# Altium schematic sheet TXMIX-SE.SchDoc: Transmitter Mixer
size E; CheckedBy: J. Brinton; CompanyName: Signal Laboratories, Inc.; DrawnBy: J. Brinton; Engineer: J. Brinton; Address1: 3479 Edison Way; Address2: Menlo Park CA 94025; Address3: +1 (877) 778-8435; Address4: siglabs.com; DocumentNumber: 55; Revision: 1; SheetNumber: 56; SheetTotal: 58
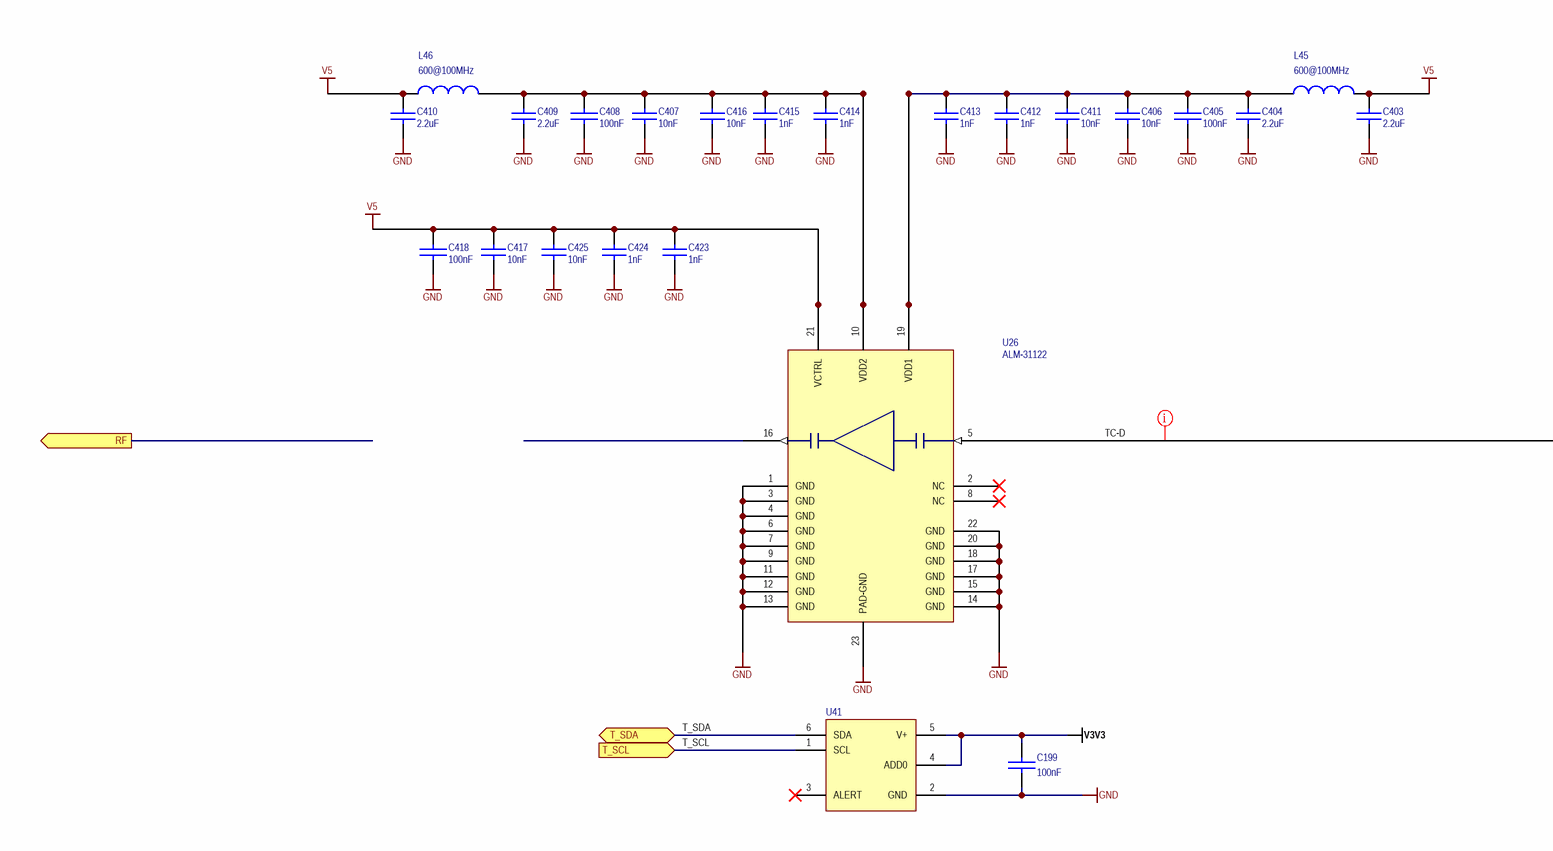
[diagram p0: TXMIX-SE.SchDoc, left]
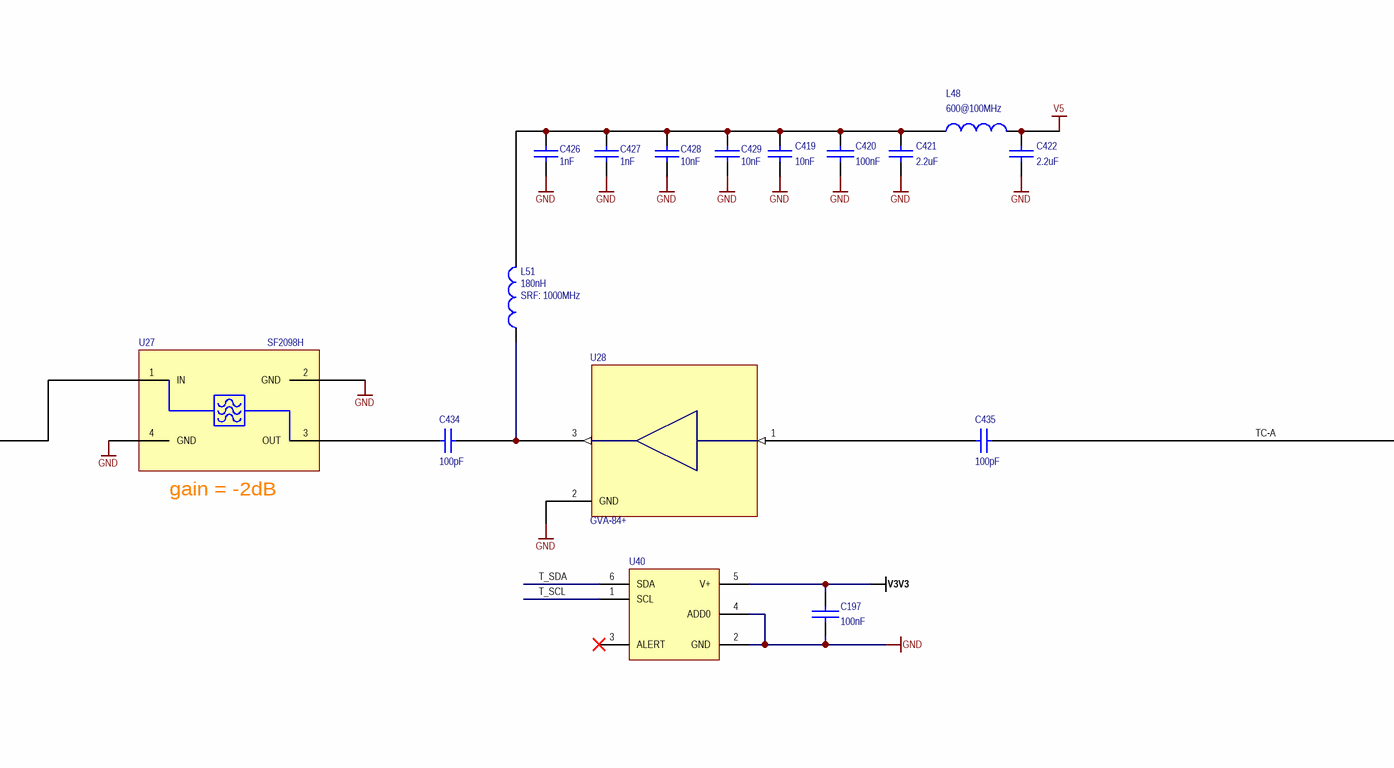
[diagram p1: TXMIX-SE.SchDoc, middle]
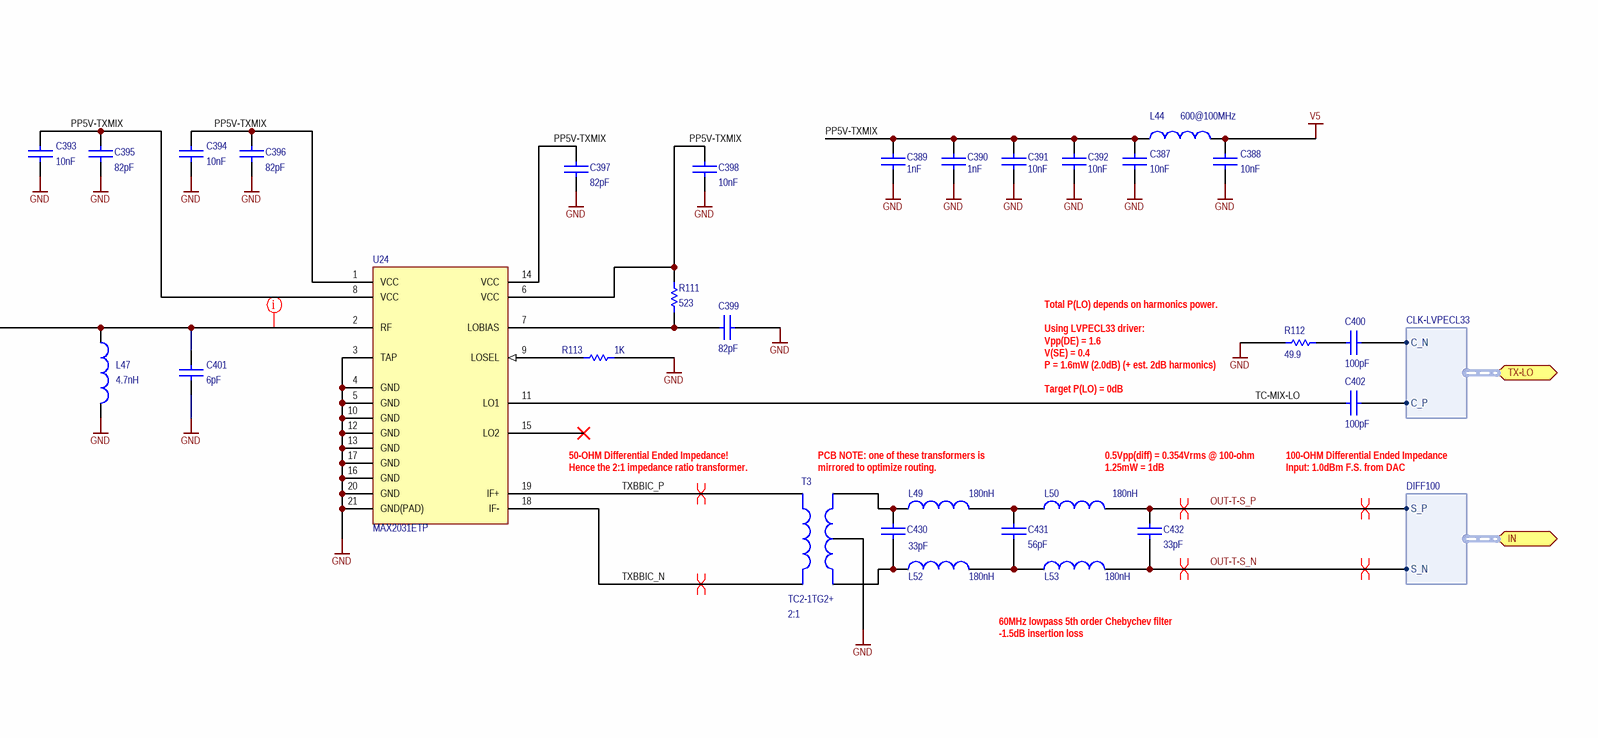
[diagram p2: TXMIX-SE.SchDoc, right]

## Parts
C197  value 100nF  [CAPC100X50X55L25N]  (hidden comment: GRM155R71C104KA88J)
C199  value 100nF  [CAPC100X50X55L25N]  (hidden comment: GRM155R71C104KA88J)
C387  value 10nF  [CAPC100X50X55L25N]  (hidden comment: GRM155R71H103KA88)
C388  value 10nF  [CAPC100X50X55L25N]  (hidden comment: GRM155R71H103KA88)
C389  value 1nF  [CAPC100X50X55L25N]  (hidden comment: GRM155R71H102KA01)
C390  value 1nF  [CAPC100X50X55L25N]  (hidden comment: GRM155R71H102KA01)
C391  value 10nF  [CAPC100X50X55L25N]  (hidden comment: GRM155R71H103KA88)
C392  value 10nF  [CAPC100X50X55L25N]  (hidden comment: GRM155R71H103KA88)
C393  value 10nF  [CAPC100X50X55L25N]  (hidden comment: GRM155R71H103KA88)
C394  value 10nF  [CAPC100X50X55L25N]  (hidden comment: GRM155R71H103KA88)
C395  value 82pF  [CAPC100X50X55L25N]  (hidden comment: VJ0402D820JXXAJ)
C396  value 82pF  [CAPC100X50X55L25N]  (hidden comment: VJ0402D820JXXAJ)
C397  value 82pF  [CAPC100X50X55L25N]  (hidden comment: VJ0402D820JXXAJ)
C398  value 10nF  [CAPC100X50X55L25N]  (hidden comment: GRM155R71H103KA88)
C399  value 82pF  [CAPC100X50X55L25N]  (hidden comment: VJ0402D820JXXAJ)
C400  value 100pF  [CAPC100X50X55L25N]  (hidden comment: CBR04C101F3GAC)
C401  value 6pF  [CAPC100X50X55L25N]  (hidden comment: GJM1555C1H6R0CB01D)
C402  value 100pF  [CAPC100X50X55L25N]  (hidden comment: CBR04C101F3GAC)
C403  value 2.2uF  [0805]  (hidden comment: GRM188R71A225KE15D)
C404  value 2.2uF  [0805]  (hidden comment: GRM188R71A225KE15D)
C405  value 100nF  [CAPC100X50X55L25N]  (hidden comment: GRM155R71C104KA88J)
C406  value 10nF  [CAPC100X50X55L25N]  (hidden comment: GRM155R71H103KA88)
C407  value 10nF  [CAPC100X50X55L25N]  (hidden comment: GRM155R71H103KA88)
C408  value 100nF  [CAPC100X50X55L25N]  (hidden comment: GRM155R71C104KA88J)
C409  value 2.2uF  [0805]  (hidden comment: GRM188R71A225KE15D)
C410  value 2.2uF  [0805]  (hidden comment: GRM188R71A225KE15D)
C411  value 10nF  [CAPC100X50X55L25N]  (hidden comment: GRM155R71H103KA88)
C412  value 1nF  [CAPC100X50X55L25N]  (hidden comment: GRM155R71H102KA01)
C413  value 1nF  [CAPC100X50X55L25N]  (hidden comment: GRM155R71H102KA01)
C414  value 1nF  [CAPC100X50X55L25N]  (hidden comment: GRM155R71H102KA01)
C415  value 1nF  [CAPC100X50X55L25N]  (hidden comment: GRM155R71H102KA01)
C416  value 10nF  [CAPC100X50X55L25N]  (hidden comment: GRM155R71H103KA88)
C417  value 10nF  [CAPC100X50X55L25N]  (hidden comment: GRM155R71H103KA88)
C418  value 100nF  [CAPC100X50X55L25N]  (hidden comment: GRM155R71C104KA88J)
C419  value 10nF  [CAPC100X50X55L25N]  (hidden comment: GRM155R71H103KA88)
C420  value 100nF  [CAPC100X50X55L25N]  (hidden comment: GRM155R71C104KA88J)
C421  value 2.2uF  [0805]  (hidden comment: GRM188R71A225KE15D)
C422  value 2.2uF  [0805]  (hidden comment: GRM188R71A225KE15D)
C423  value 1nF  [CAPC100X50X55L25N]  (hidden comment: GRM155R71H102KA01)
C424  value 1nF  [CAPC100X50X55L25N]  (hidden comment: GRM155R71H102KA01)
C425  value 10nF  [CAPC100X50X55L25N]  (hidden comment: GRM155R71H103KA88)
C426  value 1nF  [CAPC100X50X55L25N]  (hidden comment: GRM155R71H102KA01)
C427  value 1nF  [CAPC100X50X55L25N]  (hidden comment: GRM155R71H102KA01)
C428  value 10nF  [CAPC100X50X55L25N]  (hidden comment: GRM155R71H103KA88)
C429  value 10nF  [CAPC100X50X55L25N]  (hidden comment: GRM155R71H103KA88)
C430  value 33pF  [CAPC100X50X55L25N]  (hidden comment: GRM1555C1H330JA01D)
C431  value 56pF  [CAPC100X50X55L25N]  (hidden comment: GRM1555C1H560JA01D)
C432  value 33pF  [CAPC100X50X55L25N]  (hidden comment: GRM1555C1H330JA01D)
C434  value 100pF  [CAPC100X50X55L25N]  (hidden comment: CBR04C101F3GAC)
C435  value 100pF  [CAPC100X50X55L25N]  (hidden comment: CBR04C101F3GAC)
L44  value 600@100MHz  [INDC1005X55N]  (hidden comment: BLM15PX601SN1D)
L45  value 600@100MHz  [INDC1005X55N]  (hidden comment: BLM15PX601SN1D)
L46  value 600@100MHz  [INDC1005X55N]  (hidden comment: BLM15PX601SN1D)
L47  value 4.7nH  [0603]  (hidden comment: LQG18HN4N7S00D)
L48  value 600@100MHz  [INDC1005X55N]  (hidden comment: BLM15PX601SN1D)
L49  value 180nH  [0603]  (hidden comment: LQW18ANR18G00D)
L50  value 180nH  [0603]  (hidden comment: LQW18ANR18G00D)
L51  value 180nH  SRF: 1000MHz  [INDC1005X55N]  (hidden comment: LQW15CNR18J1ZD)
L52  value 180nH  [0603]  (hidden comment: LQW18ANR18G00D)
L53  value 180nH  [0603]  (hidden comment: LQW18ANR18G00D)
R111  value 523  [0603]  (hidden comment: RC0603FR-07523RL)
R112  value 49.9  [0603]  (hidden comment: ERJ-3EKF49R9V)
R113  value 1K  [RESC1005X40N]  (hidden comment: RC0402FR-071KL)
T3  value 2:1  [AT224-1A]  (hidden comment: TC2-1TG2+)
U24  MAX2031ETP  [QFN21P65_500X500X80L55X30T320N]
U26  ALM-31122  [ALM-31122]
U27  SF2098H  [SM2016-4]
U28  GVA-84+  [SOT89]
U40  TMP116AIDRVT  [SON7P65_200X200X80L25X30T170X110N]  (value not drawn)
U41  TMP116AIDRVT  [SON7P65_200X200X80L25X30T170X110N]  (value not drawn)

## Ports
IN (harness DIFF100), RF (out), T_SCL (in), T_SDA (bidir), TX-LO (harness CLK-LVPECL33)

## Harnesses
CLK-LVPECL33: C_P, C_N
DIFF100: S_P, S_N

## Nets
GND: C197.1 C199.1 C387.1 C388.1 C389.1 C390.1 C391.1 C392.1 C393.1 C394.1 C395.1 C396.1 C397.1 C398.1 C399.2 C401.1 C403.1 C404.1 C405.1 C406.1 C407.1 C408.1 C409.1 C410.1 C411.2 C412.2 C413.2 C414.2 C415.2 C416.2 C417.1 C418.1 C419.1 C420.1 C421.1 C422.1 C423.2 C424.2 C425.2 C426.1 C427.1 C428.1 C429.1 L47.1 R112.1 R113.2 T3.2(SecCT) U24.3(TAP) U24.4(GND) U24.5(GND) U24.10(GND) U24.12(GND) U24.13(GND) U24.16(GND) U24.17(GND) U24.20(GND) U24.21(GND(PAD)) U26.1(GND) U26.3(GND) U26.4(GND) U26.6(GND) U26.7(GND) U26.9(GND) U26.11(GND) U26.12(GND) U26.13(GND) U26.14(GND) U26.15(GND) U26.17(GND) U26.18(GND) U26.20(GND) U26.22(GND) U26.23(PAD-GND) U27.2(GND) U27.4(GND) U28.2(GND) U40.2(GND) U40.4(ADD0) U41.2(GND)
V3V3: C197.2 C199.2 U40.5(V+) U41.4(ADD0) U41.5(V+)
V5: C388.2 C403.2 C410.2 C417.2 C418.2 C422.2 C423.1 C424.1 C425.1 L44.1 L45.2 L46.1 L48.1 U26.21(VCTRL)
OUT-T-S_N: C432.1 L53.1 ; port IN.S_N
OUT-T-S_P: C432.2 L50.1 ; port IN.S_P
PP5V-TXMIX: C387.2 C389.2 C390.2 C391.2 C392.2 C393.2 C394.2 C395.2 C396.2 C397.2 C398.2 L44.2 R111.1 U24.1(VCC) U24.6(VCC) U24.8(VCC) U24.14(VCC)
T_SCL: U40.1(SCL) U41.1(SCL) ; port T_SCL
T_SDA: U40.6(SDA) U41.6(SDA) ; port T_SDA
TC-A: C401.2 C435.2 L47.2 U24.2(RF)
TC-D: U26.5(RFIN) U27.1(IN)
TC-MIX-LO: C402.1 U24.11(LO1)
TXBBIC_N: T3.6(Pri+) U24.18(IF-)
TXBBIC_P: T3.4(Pri-) U24.19(IF+)
NetC399_1: C399.1 R111.2 U24.7(LOBIAS)
NetC400_1: C400.1 R112.2
NetC400_2: C400.2 ; port TX-LO.C_N
NetC402_2: C402.2 ; port TX-LO.C_P
NetC404_2: C404.2 C405.2 C406.2 C411.1 C412.1 C413.1 L45.1 U26.19(VDD1)
NetC407_2: C407.2 C408.2 C409.2 C414.1 C415.1 C416.1 L46.2 U26.10(VDD2)
NetC419_2: C419.2 C420.2 C421.2 C426.2 C427.2 C428.2 C429.2 L48.2 L51.2
NetC430_1: C430.1 L52.2 T3.1(Sec+)
NetC430_2: C430.2 L49.2 T3.3(Sec-)
NetC431_1: C431.1 L52.1 L53.2
NetC431_2: C431.2 L49.1 L50.2
NetC434_1: C434.1 U27.3(OUT)
NetC434_2: C434.2 L51.1 U28.3(RFOUT)
NetC435_1: C435.1 U28.1(RFIN)
NetR113_1: R113.1 U24.9(LOSEL)

Not connected (* = marked no-connect by the designer): U24 15(LO2)*; U26 2(NC)* 8(NC)* 16(RFOUT); U40 3(ALERT)*; U41 3(ALERT)*

## Layout directives
differential pair: OUT-T-S_N, OUT-T-S_P, TXBBIC_N, TXBBIC_P
net class SE50: TC-A, TC-D

## Notes on the sheet
- (near U27) gain = -2dB
- Total P(LO) depends on harmonics power.
  Using LVPECL33 driver:
  Vpp(DE) = 1.6
  V(SE) = 0.4
  P = 1.6mW (2.0dB) (+ est. 2dB harmonics)
  Target P(LO) = 0dB
- 50-OHM Differential Ended Impedance!
  Hence the 2:1 impedance ratio transformer.
- (near T3) PCB NOTE: one of these transformers is mirrored to optimize routing.
- 0.5Vpp(diff) = 0.354Vrms @ 100-ohm
  1.25mW = 1dB
- (near C402) 100-OHM Differential Ended Impedance
  Input: 1.0dBm F.S. from DAC
- 60MHz lowpass 5th order Chebychev filter
  -1.5dB insertion loss
- Title
- Engineer
- Revision
- Drawn By
- Checked By
- Date
- Sheet
- of

## Library data of the parts
C197 C199 C405 C408 C418 C420 = CAP: Ceramic Capacitor 100nF ±10% 16V X7R 0402; Manufacturer: Murata; Tr: -55:125; Manufacturer P/N: GRM155R71C104KA88J; Voltage: 16V; Package: 0402; Tolerance: ±10%
C387 C388 C391-C394 C398 C406 C407 C411 C416 C417 C419 C425 C428 C429 = CAP 0402: Ceramic Capacitor 10nF ±10% 50V X7R 0402; Manufacturer: Murata; Tr: -55:125; Voltage: 50V; Manufacturer P/N: GRM155R71H103KA88; Package: 0402; Tolerance: ±10%
C389 C390 C412-C415 C423 C424 C426 C427 = CAP 0402: Ceramic Capacitor 1nF ±10% 50V X7R 0402; Manufacturer: Murata; Tolerance: ±5%; Tr: -55:125; Voltage: 50V; Manufacturer P/N: GRM155R71H102KA01; Package: CAPC100X50X55L25N
C395-C397 C399 = CAP: Ceramic Capacitor 82pF ±5% 25V NP0 0402; Manufacturer: Vishay Vitramon; Tr: 55:125; Voltage: 25V; Manufacturer P/N: VJ0402D820JXXAJ; Tolerance: ±5%; Footprint: *; Package: 0402
C400 C402 C434 C435 = CAP 0603: Ceramic Capacitor 100pF ±1% 25V NP0 0402; Manufacturer: Kemet; Tr: -55:125; Voltage: 25V; Manufacturer P/N: CBR04C101F3GAC; Package: CAPC100X50X55L25N; Tolerance: ±1%
C401 = CAP 0402: Ceramic Capacitor 6pF ±0.25pF 50V NP0 RF 0402; Manufacturer: Murata; Tr: -55:125; Voltage: 50V; Manufacturer P/N: GJM1555C1H6R0CB01D; Package: 0402; Tolerance: ±0.25pF
C403 C404 C409 C410 C421 C422 = CAP 0805: Ceramic Capacitor 2.2uF ±10% 10V X7R 0603; Manufacturer: Murata; Tr: -55:125; Voltage: 10V; Manufacturer P/N: GRM188R71A225KE15D; Package: 0603; Do Not Place: *; Tolerance: ±10%
C430 C432 = CAP 0402: Ceramic Capacitor 33pF ±5% 50V NP0 0402; Manufacturer: Murata; Tr: -55:125; Voltage: 50V; Manufacturer P/N: GRM1555C1H330JA01D; Package: 0402; Tolerance: ±5%
C431 = CAP 0402: Ceramic Capacitor 56pF ±5% 50V NP0 0402; Manufacturer: Murata; Tr: -55:125; Voltage: 50V; Manufacturer P/N: GRM1555C1H560JA01D; Package: 0402; Tolerance: ±5%
L44-L46 L48 = IND 0402: Ferrite Bead 600-Ohm @ 100MHz 900mA 0402; Manufacturer: Murata; Tolerance: ±25%; Tr: -55:125; Manufacturer P/N: BLM15PX601SN1D; Package: 0402
L47 = IND 0603: Inductor Multilayer 4.7nH ±5% 0603; Manufacturer: Murata; Tolerance: ±0.3nH; Tr: -55:125; Manufacturer P/N: LQG18HN4N7S00D; Package: 0603
L49 L50 L52 L53 = INDUCTOR: Inductor Wirewound 180nH ±2% 0603; Manufacturer: Murata; Tr: -55:125; Manufacturer P/N: LQW18ANR18G00D; Package: 0603; Tolerance: ±2%
L51 = IND 0603: Wirewound Inductor 180nH 560mA 0402; Manufacturer: Murata; PCB Package: 0402; Manufacturer P/N: LQW15CNR18J1ZD; Do Not Place: *
R111 = RES 0603: Thick Film Resistor 523 ±1% 0603; Manufacturer: Yageo; Tr: -55:155; Package: 0603; Manufacturer P/N: RC0603FR-07523RL; Tolerance: ±1%
R112 = RES 0603: Thick Film Resistor 49.9 ±1% 0603; Manufacturer: Panasonic; Tr: -55:155; Package: 0603; Manufacturer P/N: ERJ-3EKF49R9V; Tolerance: ±1%
R113 = RES 0402: Thick Film Resistor 1k ±1% 0402; Manufacturer: Yageo; Tr: -55:155; Package: 0402; Manufacturer P/N: RC0402FR-071KL; Do Not Place: *; Tolerance: ±1%
T3 = TC1-1TG2+: RF Transformer 0.4 to 500MHz SMD; Manufacturer: Mini-Circuits; Manufacturer P/N: TC2-1TG2+
U24 = MAX2031ETP: Upconversion/Downconversion Mixer; Manufacturer: Maxim; Manufacturer P/N: MAX2031ETP
U26 = ALM-31122: 1-watt High-Linearity Power Amplifier; Manufacturer: Avago; Manufacturer P/N: ALM-31122
U27 = SF2098H: 915 MHz SAW Filter; Manufacturer: RFM; Manufacturer P/N: SF2098H
U28 = GVA-84+: High Gain Monolithic Amplifier, DC-7GHz 24dB Gain; Manufacturer: Mini-Circuits; Manufacturer P/N: GVA-84+
U40 U41 = TMP116AIDRV: High-Accuracy Temperature Sensor; Manufacturer: Texas Instruments; Manufacturer P/N: TMP116AIDRV